# EAGLE schematic KeDei_v6_2 (EAGLE 6.6.0)
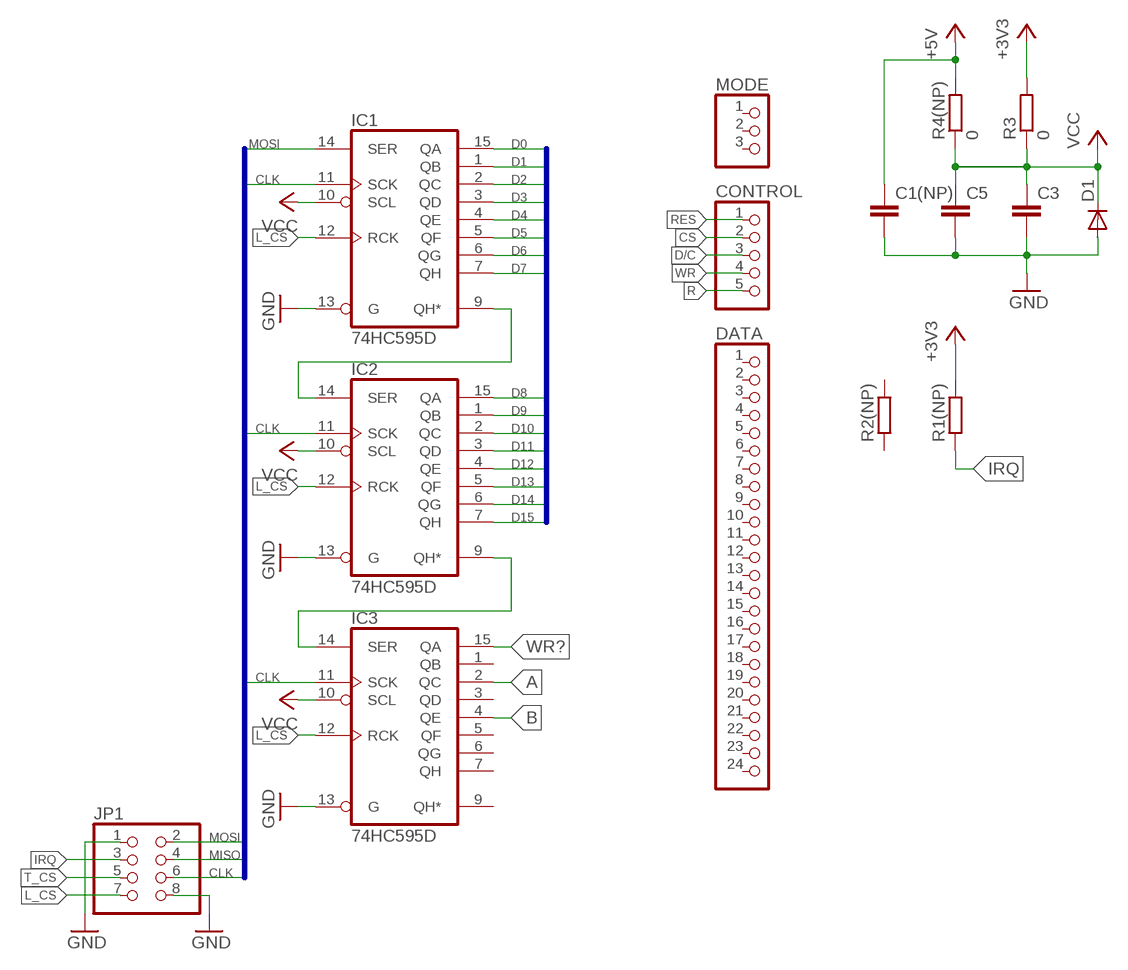
[diagram p0: schematic, sheet 1]

## Parts
C1(NP)  C-EUC0603  [C0603]
C3  C-EUC0603  [C0603]
C5  C-EUC0603  [C0603]
CONTROL  PINHD-1X5  [1X05]
D1  DIODE-MICROMELF-W  [MICROMELF-W]
DATA  PINHD-1X24  [1X24]
IC1  74HC595D  [SO16]
IC2  74HC595D  [SO16]
IC3  74HC595D  [SO16]
JP1  PINHD-2X4  [2X04]
MODE  PINHD-1X3  [1X03]
R1(NP)  R-EU_R0603  [R0603]
R2(NP)  R-EU_R0603  [R0603]
R3  0  R-EU_R0603  [R0603]
R4(NP)  0  R-EU_R0603  [R0603]

## Nets
+3V3: R1(NP).2 R3.2
+5V: C1(NP).1 R4(NP).2
A: IC3.2(QC)
B: IC3.4(QE)
CLK: IC1.11(SCK) IC2.11(SCK) IC3.11(SCK) JP1.6
CS: CONTROL.2
D0: IC1.15(QA)
D1: IC1.1(QB)
D2: IC1.2(QC)
D3: IC1.3(QD)
D4: IC1.4(QE)
D5: IC1.5(QF)
D6: IC1.6(QG)
D7: IC1.7(QH)
D8: IC2.15(QA)
D9: IC2.1(QB)
D10: IC2.2(QC)
D11: IC2.3(QD)
D12: IC2.4(QE)
D13: IC2.5(QF)
D14: IC2.6(QG)
D15: IC2.7(QH)
D/C: CONTROL.3
GND: C1(NP).2 C3.2 C5.2 D1.A IC1.13(G) IC2.13(G) IC3.13(G) JP1.1 JP1.8
IRQ: JP1.3 R1(NP).1
L_CS: IC1.12(RCK) IC2.12(RCK) IC3.12(RCK) JP1.7
MISO: JP1.4
MOSI: IC1.14(SER) JP1.2
N$1: IC2.9(QH*) IC3.14(SER)
N$2: IC1.9(QH*) IC2.14(SER)
R: CONTROL.5
RES: CONTROL.1
T_CS: JP1.5
VCC: C3.1 C5.1 D1.C IC1.10(SCL) IC2.10(SCL) IC3.10(SCL) R3.1 R4(NP).1
WR: CONTROL.4
WR?: IC3.15(QA)
Unconnected: DATA.1 DATA.2 DATA.3 DATA.4 DATA.5 DATA.6 DATA.7 DATA.8 DATA.9 DATA.10 DATA.11 DATA.12 DATA.13 DATA.14 DATA.15 DATA.16 DATA.17 DATA.18 DATA.19 DATA.20 DATA.21 DATA.22 DATA.23 DATA.24 IC3.1(QB) IC3.3(QD) IC3.5(QF) IC3.6(QG) IC3.7(QH) IC3.9(QH*) MODE.1 MODE.2 MODE.3 R2(NP).1 R2(NP).2

## Buses
SPI:MOSI,MISO,CLK
DATA:D[0..15]

## Power pins joined to a net without a drawn wire
GND: IC1.8(GND) IC2.8(GND) IC3.8(GND)
VCC: IC1.16(VCC) IC2.16(VCC) IC3.16(VCC)

## Library data of the parts
C1(NP) C3 C5 = rcl:C-EU: CAPACITOR, European symbol
CONTROL = pinhead:PINHD-1X5: PIN HEADER
D1 = diode:DIODE-: DIODE
DATA = pinhead:PINHD-1X24: PIN HEADER
IC1-IC3 = 74xx-eu:74*595: 8-bit SHIFT REGISTER, output latch
JP1 = pinhead:PINHD-2X4: PIN HEADER
MODE = pinhead:PINHD-1X3: PIN HEADER
R1(NP) R2(NP) R3 R4(NP) = rcl:R-EU_: RESISTOR, European symbol